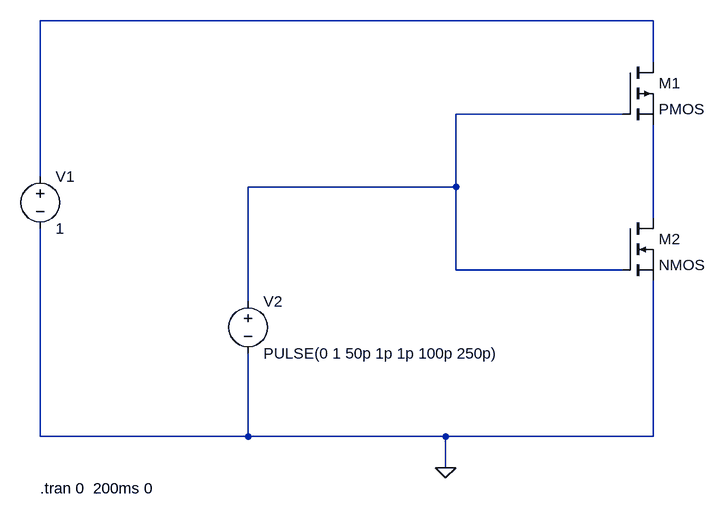
[diagram p0: schematic Draft1.asc]
Draft1.asc, the LTspice schematic file:
Version 4
SHEET 1 880 984
WIRE 208 160 -736 160
WIRE 208 224 208 160
WIRE 160 304 -96 304
WIRE -736 400 -736 160
WIRE -96 416 -96 304
WIRE -96 416 -416 416
WIRE 208 464 208 320
WIRE -96 544 -96 416
WIRE 160 544 -96 544
WIRE -416 592 -416 416
WIRE -736 800 -736 480
WIRE -416 800 -416 672
WIRE -416 800 -736 800
WIRE -112 800 -416 800
WIRE 208 800 208 560
WIRE 208 800 -112 800
WIRE -112 848 -112 800
FLAG -112 848 0
SYMBOL voltage -736 384 R0
WINDOW 39 24 118 Left 2
SYMATTR InstName V1
SYMATTR Value 1
SYMBOL pmos 160 224 R0
SYMATTR InstName M1
SYMBOL voltage -416 576 R0
WINDOW 123 0 0 Left 0
WINDOW 39 0 0 Left 0
SYMATTR InstName V2
SYMATTR Value PULSE(0 1 50p 1p 1p 100p 250p)
SYMBOL nmos 160 464 R0
SYMATTR InstName M2
TEXT -736 880 Left 2 !.tran 0  200ms 0

The netlist it stands for:
* Draft1.asc
V1 N001 0 1
M1 N001 N002 N003 N003 PMOS
V2 N002 0 PULSE(0 1 50p 1p 1p 100p 250p)
M2 N003 N002 0 0 NMOS
.model NMOS NMOS
.model PMOS PMOS
.lib standard.mos
.tran 0  200ms 0
.backanno
.end